# Altium schematic sheet Sheet1.SchDoc
size 594 x 420 mm; Organization: ФЕЛ, ДК-91; SheetNumber: 1; SheetTotal: 1
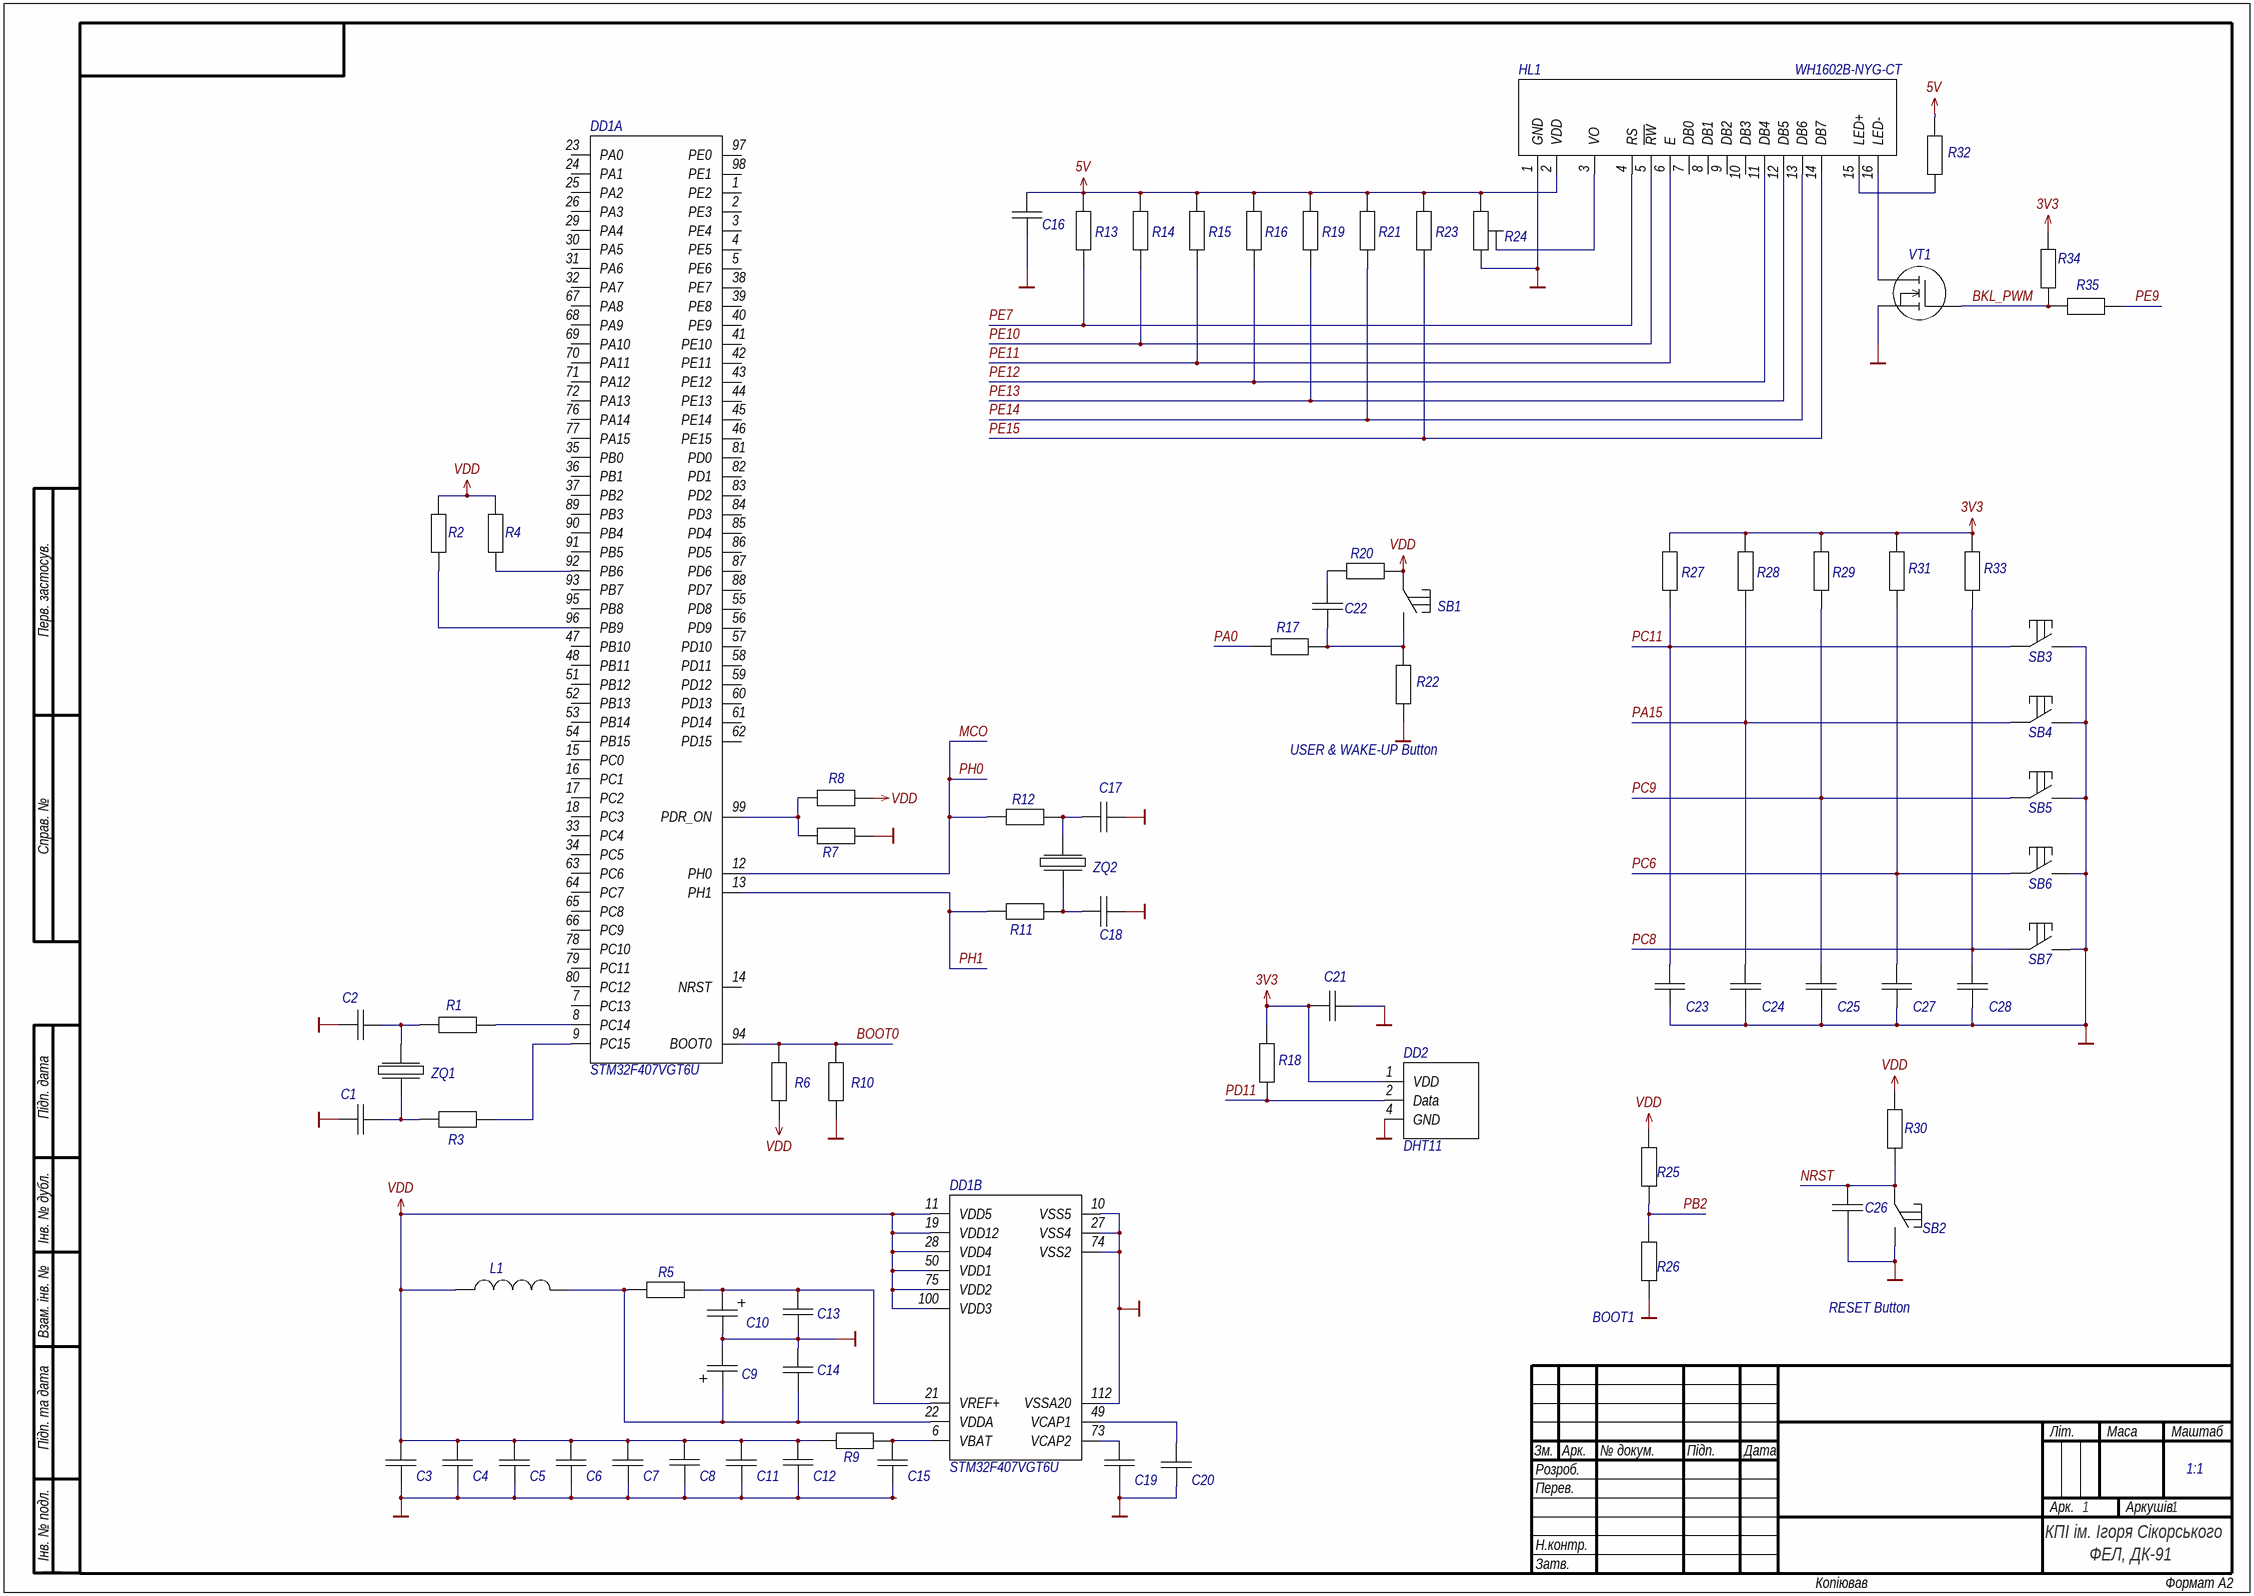
[diagram p0: Sheet1.SchDoc]

## Parts
C1  0603 16 В 6,8 пФ 5% C0G, NP0 Kemet  [C-0603, 22 пФ]  (value not drawn)
C2  0603 16 В 6,8 пФ 5% C0G, NP0 Kemet  [C-0603, 22 пФ]  (value not drawn)
C3  0603 16 В 100 нФ 5% X7R Samsung  [C-0603, 100 нФ]  (value not drawn)
C4  0603 16 В 100 нФ 5% X7R Samsung  [C-0603, 100 нФ]  (value not drawn)
C5  0603 16 В 100 нФ 5% X7R Samsung  [C-0603, 100 нФ]  (value not drawn)
C6  0603 16 В 100 нФ 5% X7R Samsung  [C-0603, 100 нФ]  (value not drawn)
C7  0603 16 В 100 нФ 5% X7R Samsung  [C-0603, 100 нФ]  (value not drawn)
C8  0603 16 В 100 нФ 5% X7R Samsung  [C-0603, 100 нФ]  (value not drawn)
C9  1206 16 В 1 мкФ 10% KYOCERA AVX  [C-1206, 10 мкФ]  (value not drawn)
C10  1206 16 В 1 мкФ 10% KYOCERA AVX  [C-1206, 10 мкФ]  (value not drawn)
C11  0603 16 В 100 нФ 5% X7R Samsung  [C-0603, 100 нФ]  (value not drawn)
C12  0603 16 В 100 нФ 5% X7R Samsung  [C-0603, 100 нФ]  (value not drawn)
C13  0603 16 В 100 нФ 5% X7R Samsung  [C-0603, 100 нФ]  (value not drawn)
C14  0603 16 В 100 нФ 5% X7R Samsung  [C-0603, 100 нФ]  (value not drawn)
C15  0603 16 В 1 мкФ 5% X7R Kemet  [C-0603, 1 мкФ]  (value not drawn)
C16  0603 16 В 0,1 мкФ 5% X7R Kemet  [C-0603, 1 мкФ]  (value not drawn)
C17  0603 16 В 20 пФ 5% C0G, NP0 Kemet  [C-0603, 22 пФ]  (value not drawn)
C18  0603 16 В 20 пФ 5% C0G, NP0 Kemet  [C-0603, 22 пФ]  (value not drawn)
C19  0603 16 В 2,2 мкФ 5% X7R Kemet  [C-0603, 1 мкФ]  (value not drawn)
C20  0603 16 В 2,2 мкФ 5% X7R Kemet  [C-0603, 1 мкФ]  (value not drawn)
C21  0603 16 В 0,1 мкФ 5% X7R Kemet  [C-0603, 1 мкФ]  (value not drawn)
C22  0603 16 В 100 нФ 5% X7R Samsung  [C-0603, 100 нФ]  (value not drawn)
C23  0603 16 В 0,01 мкФ 5% X7R Kemet  [C-0603, 1 мкФ]  (value not drawn)
C24  0603 16 В 0,01 мкФ 5% X7R Kemet  [C-0603, 1 мкФ]  (value not drawn)
C25  0603 16 В 0,01 мкФ 5% X7R Kemet  [C-0603, 1 мкФ]  (value not drawn)
C26  0603 16 В 100 нФ 5% X7R Samsung  [C-0603, 100 нФ]  (value not drawn)
C27  0603 16 В 0,01 мкФ 5% X7R Kemet  [C-0603, 1 мкФ]  (value not drawn)
C28  0603 16 В 0,01 мкФ 5% X7R Kemet  [C-0603, 1 мкФ]  (value not drawn)
DD1  STM32F407VGT6U STMicroelectronics  (value not drawn)  (parts A,B of 2)
DD2  DHT11 Asair  (value not drawn)
HL1  Name: WH1602B-NYG-CT  (hidden comment: WH1602B-NYG-CT WINSTAR)
L1  fcm1608-0603 Bourns Electronics  [IND_BOURNS_MH2029]  (value not drawn)
R1  0603 0,1 Вт 0 Ом Jumper Panasonic  [R-0603, 0 Ом]  (value not drawn)
R2  0603 0,25 Вт 4,7 кОм 5% Panasonic  [R-0603, 6,8 кОм]  (value not drawn)
R3  0603 0,1 Вт 0 Ом Jumper Panasonic  [R-0603, 0 Ом]  (value not drawn)
R4  0603 0,25 Вт 4,7 кОм 5% Panasonic  [R-0603, 6,8 кОм]  (value not drawn)
R5  R-0603 0,1 Вт 47 Ом 5% Panasonic Electronic Components  [0603 47 Ом]  (value not drawn)
R6  0603 0,25 Вт 10 кОм 5% Panasonic  [R-0603, 10 кОм]  (value not drawn)
R7  0603 0,1 Вт 0 Ом Jumper Panasonic  [R-0603, 0 Ом]  (value not drawn)
R8  0603 0,1 Вт 0 Ом Jumper Panasonic  [R-0603, 0 Ом]  (value not drawn)
R9  0603 0,1 Вт 0 Ом Jumper Panasonic  [R-0603, 0 Ом]  (value not drawn)
R10  R-0603 0,1 Вт 510 Ом 5% Panasonic Electronic Components  [0603 330 Ом]  (value not drawn)
R11  R-0603 0,1 Вт 220 Ом 5% Panasonic Electronic Components  [0603 270 Ом]  (value not drawn)
R12  0603 0,1 Вт 0 Ом Jumper Panasonic  [R-0603, 0 Ом]  (value not drawn)
R13  0603 0,25 Вт 4,7 кОм 5% Panasonic  [R-0603, 6,8 кОм]  (value not drawn)
R14  0603 0,25 Вт 4,7 кОм 5% Panasonic  [R-0603, 6,8 кОм]  (value not drawn)
R15  0603 0,25 Вт 4,7 кОм 5% Panasonic  [R-0603, 6,8 кОм]  (value not drawn)
R16  0603 0,25 Вт 4,7 кОм 5% Panasonic  [R-0603, 6,8 кОм]  (value not drawn)
R17  R-0603 0,1 Вт 330 Ом 5% Panasonic Electronic Components  [0603 330 Ом]  (value not drawn)
R18  0603 0,25 Вт 2 кОм 5% Panasonic  [R-0603, 1кОм]  (value not drawn)
R19  0603 0,25 Вт 4,7 кОм 5% Panasonic  [R-0603, 6,8 кОм]  (value not drawn)
R20  (no value)  [0603 100 Ом]
R21  0603 0,25 Вт 4,7 кОм 5% Panasonic  [R-0603, 6,8 кОм]  (value not drawn)
R22  R-0603 0,1 Вт 220 кОм 5% Panasonic Electronic Components  [0603 330 кОм]  (value not drawn)
R23  0603 0,25 Вт 4,7 кОм 5% Panasonic  [R-0603, 6,8 кОм]  (value not drawn)
R24  Tube 0,5 Вт 10 кОм 10% Bourns Inc.  [R-Tube]  (value not drawn)
R25  0603 0,25 Вт 10 кОм 5% Panasonic  [R-0603, 10 кОм]  (value not drawn)
R26  R-0603 0,1 Вт 510 Ом 5% Panasonic Electronic Components  [0603 330 Ом]  (value not drawn)
R27  0603 0,25 Вт 4,7 кОм 5% Panasonic  [R-0603, 6,8 кОм]  (value not drawn)
R28  0603 0,25 Вт 4,7 кОм 5% Panasonic  [R-0603, 6,8 кОм]  (value not drawn)
R29  0603 0,25 Вт 4,7 кОм 5% Panasonic  [R-0603, 6,8 кОм]  (value not drawn)
R30  0603 0,25 Вт 100 кОм 5% Panasonic  [R-0603, 100 кОм]  (value not drawn)
R31  0603 0,25 Вт 4,7 кОм 5% Panasonic  [R-0603, 6,8 кОм]  (value not drawn)
R32  (no value)  [0603 100 Ом]
R33  0603 0,25 Вт 4,7 кОм 5% Panasonic  [R-0603, 6,8 кОм]  (value not drawn)
R34  0603 0,25 Вт 4,7 кОм 5% Panasonic  [R-0603, 6,8 кОм]  (value not drawn)
R35  (no value)  [0603 100 Ом]
SB1  RS032G05A3SMRT C&K  [SB 2 pin]  (value not drawn)
SB2  RS032G05A3SMRT C&K  [SB 2 pin]  (value not drawn)
SB3  RS032G05A3SMRT C&K  [SB 2 pin]  (value not drawn)
SB4  RS032G05A3SMRT C&K  [SB 2 pin]  (value not drawn)
SB5  RS032G05A3SMRT C&K  [SB 2 pin]  (value not drawn)
SB6  RS032G05A3SMRT C&K  [SB 2 pin]  (value not drawn)
SB7  RS032G05A3SMRT C&K  [SB 2 pin]  (value not drawn)
VT1  IRLML2402TRPBF Infineon Technologies  [VT IRFZ44NLPBF]  (value not drawn)
ZQ1  MC306-G-06Q-32.768 JFVNY  [ZQ 32,768 kHz]  (value not drawn)
ZQ2  J49SMH-P-G-G-K-8M0 Jauch Quartz  [ZQ 32,768 kHz]  (value not drawn)

## Nets
3V3: C21.1 DD2.1(VDD) R18.2 R27.2 R28.2 R29.2 R31.2 R33.2 R34.2
5V: C16.2 HL1.2(VDD) R13.2 R14.2 R15.2 R16.2 R19.2 R21.2 R23.2 R24.1 R32.2
GND: C1.1 C2.1 C3.1 C4.1 C5.1 C6.1 C7.1 C8.2 C9.2 C10.2 C11.1 C12.2 C13.1 C14.1 C15.1 C16.1 C17.2 C18.2 C19.1 C20.1 C21.2 C23.1 C24.1 C25.1 C26.1 C27.1 C28.1 DD1.10(VSS5) DD1.27(VSS4) DD1.74(VSS2) DD1.112(VSSA20) DD2.4(GND) HL1.1(GND) R7.2 R10.1 R22.1 R24.3 R26.1 SB2.2 SB3.2 SB4.2 SB5.2 SB6.2 SB7.2 VT1.3
VDD: C3.2 C4.2 C5.2 C6.2 C7.2 C8.1 C11.2 C12.1 DD1.11(VDD5) DD1.19(VDD12) DD1.28(VDD4) DD1.50(VDD1) DD1.75(VDD2) DD1.100(VDD3) L1.1 R2.2 R4.2 R6.1 R8.2 R9.1 R20.2 R25.2 R30.2 SB1.1
BKL_PWM: R34.1 R35.1 VT1.1
BOOT0: DD1.94(BOOT0) R6.2 R10.2
MCO: DD1.12(PH0) R12.1  [also labelled PH0]
NRST: C26.2 R30.1 SB2.1
PA0: R17.1
PA15: C24.2 R28.1 SB4.1
PB2: R25.1 R26.2
PC6: C27.2 R31.1 SB6.1
PC8: C28.2 R33.1 SB7.1
PC9: C25.2 R29.1 SB5.1
PC11: C23.2 R27.1 SB3.1
PD11: DD2.2(Data) R18.1
PE7: HL1.4(RS) R13.1
PE9: R35.2
PE10: HL1.5(~{RW}) R14.1
PE11: HL1.6(E) R15.1
PE12: HL1.11(DB4) R16.1
PE13: HL1.12(DB5) R19.1
PE14: HL1.13(DB6) R21.1
PE15: HL1.14(DB7) R23.1
PH1: DD1.13(PH1) R11.1
NetC1_2: C1.2 R3.1 ZQ1.1(In/Out)
NetC2_2: C2.2 R1.1 ZQ1.2(Out/In)
NetC9_1: C9.1 C14.2 DD1.22(VDDA) L1.2 R5.1
NetC10_1: C10.1 C13.2 DD1.21(VREF+) R5.2
NetC15_2: C15.2 DD1.6(VBAT) R9.2
NetC17_1: C17.1 R12.2 ZQ2.2(Out/In)
NetC18_1: C18.1 R11.2 ZQ2.1(In/Out)
NetC19_2: C19.2 DD1.73(VCAP2)
NetC20_2: C20.2 DD1.49(VCAP1)
NetC22_1: C22.1 R17.2 R22.2 SB1.2
NetC22_2: C22.2 R20.1
NetDD1_8: DD1.8(PC14) R1.2
NetDD1_9: DD1.9(PC15) R3.2
NetDD1_92: DD1.92(PB6) R4.1
NetDD1_96: DD1.96(PB9) R2.1
NetDD1_99: DD1.99(PDR_ON) R7.1 R8.1
NetHL1_3: HL1.3(VO) R24.2
NetHL1_15: HL1.15(LED+) R32.1
NetHL1_16: HL1.16(LED-) VT1.2

Not connected (* = marked no-connect by the designer): DD1 1(PE2) 2(PE3) 3(PE4) 4(PE5) 5(PE6) 7(PC13) 14(NRST) 15(PC0) 16(PC1) 17(PC2) 18(PC3) 23(PA0) 24(PA1) 25(PA2) 26(PA3) 29(PA4) 30(PA5) 31(PA6) 32(PA7) 33(PC4) 34(PC5) 35(PB0) 36(PB1) 37(PB2) 38(PE7) 39(PE8) 40(PE9) 41(PE10) 42(PE11) 43(PE12) 44(PE13) 45(PE14) 46(PE15) 47(PB10) 48(PB11) 51(PB12) 52(PB13) 53(PB14) 54(PB15) 55(PD8) 56(PD9) 57(PD10) 58(PD11) 59(PD12) 60(PD13) 61(PD14) 62(PD15) 63(PC6) 64(PC7) 65(PC8) 66(PC9) 67(PA8) 68(PA9) 69(PA10) 70(PA11) 71(PA12) 72(PA13) 76(PA14) 77(PA15) 78(PC10) 79(PC11) 80(PC12) 81(PD0) 82(PD1) 83(PD2) 84(PD3) 85(PD4) 86(PD5) 87(PD6) 88(PD7) 89(PB3) 90(PB4) 91(PB5) 93(PB7) 95(PB8) 97(PE0) 98(PE1); HL1 7(DB0) 8(DB1) 9(DB2) 10(DB3)

## Notes on the sheet
- USER & WAKE-UP Button
- (near R26) BOOT1
- RESET Button
- 1:1
- Перв. застосув.
- Справ. №
- Підп. дата
- Інв. № дубл.
- Взам. інв. №
- Підп. та дата
- Зм.
- Розроб.
- Арк.
- № докум.
- Підп.
- Дата
- Літ.
- Маса
- Маштаб
- Перев.
- Аркушів
- Інв. № подл.
- Н.контр.
- Затв.
- КПІ ім. Ігоря Сікорського
- ALTIUM GOSTBOM2.0 KEV
- Копіював
- Формат А2

## Library data of the parts
C1 C2 = C-0603, 6,8 пФ: Capasitor 0603; Value: 6,8 пФ; Voltage: 16 В; Manufacturer: Kemet; Tolerance: 5%; Temp_Coef: C0G, NP0; Package: 0603
C3-C8 C11-C14 C22 C26 = C-0603, 100 нФ: Capasitor 0603; Voltage: 16 В; Value: 100 нФ; Manufacturer: Samsung; Tolerance: 5%; Package: 0603; Temp_Coef: X7R
C9 C10 = С-1206, 1 мкФ: Capasitor; Voltage: 16 В; Value: 1 мкФ; Manufacturer: KYOCERA AVX; Tolerance: 10%; Package: 1206
C15 = C-0603, 1 мкФ: Capasitor 0603; Value: 1 мкФ; Voltage: 16 В; Manufacturer: Kemet; Package: 0603; Tolerance: 5%; Temp_Coef: X7R
C16 C21 = C-0603, 0,1 мкФ: Capasitor 0603; Value: 0,1 мкФ; Voltage: 16 В; Manufacturer: Kemet; Package: 0603; Tolerance: 5%; Temp_Coef: X7R
C17 C18 = C-0603, 20 пФ: Capasitor 0603; Value: 20 пФ; Voltage: 16 В; Manufacturer: Kemet; Tolerance: 5%; Temp_Coef: C0G, NP0; Package: 0603
C19 C20 = C-0603, 2,2 мкФ: Capasitor 0603; Value: 2,2 мкФ; Voltage: 16 В; Manufacturer: Kemet; Package: 0603; Tolerance: 5%; Temp_Coef: X7R
C23-C25 C27 C28 = C-0603, 0,01 мкФ: Capasitor 0603; Voltage: 16 В; Manufacturer: Kemet; Value: 0,01 мкФ; Package: 0603; Tolerance: 5%; Temp_Coef: X7R
DD1 = STM32F407VGT6U: Name: STM32F407VGT6U; Manufacturer: STMicroelectronics
DD2 = dht11: Name: DHT11; Manufacturer: Asair
HL1 = lcd: Manufacturer: WINSTAR
L1 = fcm1608-0603: Manufacturer: Bourns Electronics; Name: fcm1608-0603
R1 R3 R7-R9 R12 = R-0603, 0 Ом: Resistor 0603; Value: 0 Ом; Power: 0,1 Вт; Manufacturer: Panasonic; Tolerance: Jumper; Package: 0603
R2 R4 R13-R16 R19 R21 R23 R27-R29 R31 R33 R34 = R-0603, 4,7 кОм: Resistor 0603; Value: 4,7 кОм; Power: 0,25 Вт; Manufacturer: Panasonic; Tolerance: 5%; Package: 0603
R5 = R-0603 47 Ом: Power: 0,1 Вт; Value: 47 Ом; Package: R-0603; Tolerance: 5%; Manufacturer: Panasonic Electronic Components
R6 R25 = R-0603, 10 кОм: Resistor 0603; Value: 10 кОм; Power: 0,25 Вт; Manufacturer: Panasonic; Tolerance: 5%; Package: 0603
R10 R26 = R-0603 510 Ом: Power: 0,1 Вт; Value: 510 Ом; Package: R-0603; Tolerance: 5%; Manufacturer: Panasonic Electronic Components
R11 = R-0603 220 Ом: Power: 0,1 Вт; Value: 220 Ом; Package: R-0603; Tolerance: 5%; Manufacturer: Panasonic Electronic Components
R17 = R-0603 330 Ом: Power: 0,1 Вт; Value: 330 Ом; Package: R-0603; Tolerance: 5%; Manufacturer: Panasonic Electronic Components
R18 = R-0603, 2кОм: Resistor 0603; Value: 2 кОм; Power: 0,25 Вт; Manufacturer: Panasonic; Tolerance: 5%; Package: 0603
R20 R32 R35 = R-0603 100 Ом: Manufacturer: Panasonic Electronic Components; Pover: 0,1 Вт; Value: 100 Ом; Tolerance: 5%; Package: R-0603
R22 = R-0603 220 кОм: Power: 0,1 Вт; Value: 220 кОм; Package: R-0603; Tolerance: 5%; Manufacturer: Panasonic Electronic Components
R24 = R-Tube 10 кОм: Power: 0,5 Вт; Value: 10 кОм; Package: Tube; Tolerance: 10%; Manufacturer: Bourns Inc.
R30 = R-0603, 100 кОм: Resistor 0603; Power: 0,25 Вт; Value: 100 кОм; Manufacturer: Panasonic; Tolerance: 5%; Package: 0603
SB1-SB7 = SB 2pin: Tactile Switch SPST-NO Top Actuated Surface Mount; Manufacturer: C&K; Name: RS032G05A3SMRT
VT1 = VT IRLML2402TRPBF: Name: IRLML2402TRPBF; Manufacturer: Infineon Technologies
ZQ1 = ZQ 32,768 kHz: Name: MC306-G-06Q-32.768; Manufacturer: JFVNY
ZQ2 = ZQ 8 MHz: Name: J49SMH-P-G-G-K-8M0; Manufacturer: Jauch Quartz